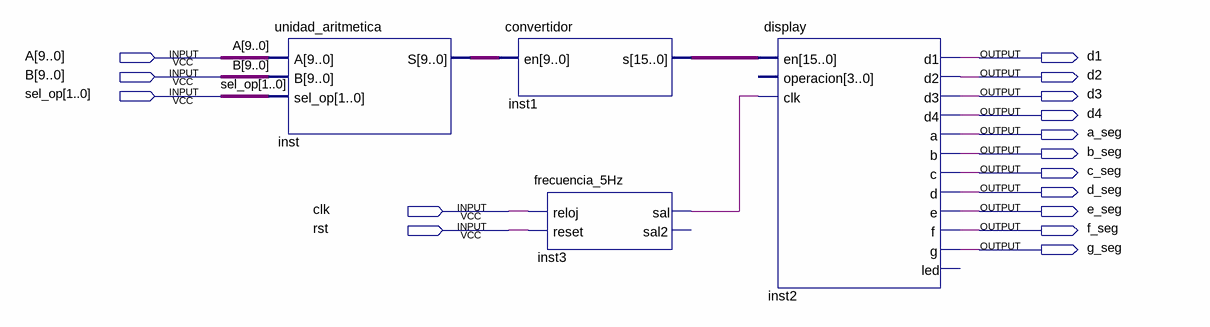
[diagram p0: schematic sheet]
// Quartus schematic practica1alu.bdf as structural Verilog: 4 symbols, 16 pins
module practica1alu (
  input  [9:0] A,
  input  [9:0] B,
  input  [1:0] sel_op,
  input  clk,
  input  rst,
  output d1,
  output d2,
  output d3,
  output d4,
  output a_seg,
  output b_seg,
  output c_seg,
  output d_seg,
  output e_seg,
  output f_seg,
  output g_seg
);

  wire inst3_sal;
  wire [9:0] inst_s;
  wire [15:0] inst1_s;

  unidad_aritmetica inst (.A(A), .B(B), .sel_op(sel_op), .S(inst_s));
  convertidor inst1 (.en(inst_s), .s(inst1_s));
  frecuencia_5Hz inst3 (.reloj(clk), .reset(rst), .sal(inst3_sal));  // open: sal2
  display inst2 (
    .en(inst1_s), .clk(inst3_sal), .d1(d1), .d2(d2), .d3(d3), .d4(d4), .a(a_seg), .b(b_seg), .c(c_seg),
    .d(d_seg), .e(e_seg), .f(f_seg), .g(g_seg));  // open: operacion, led
endmodule
